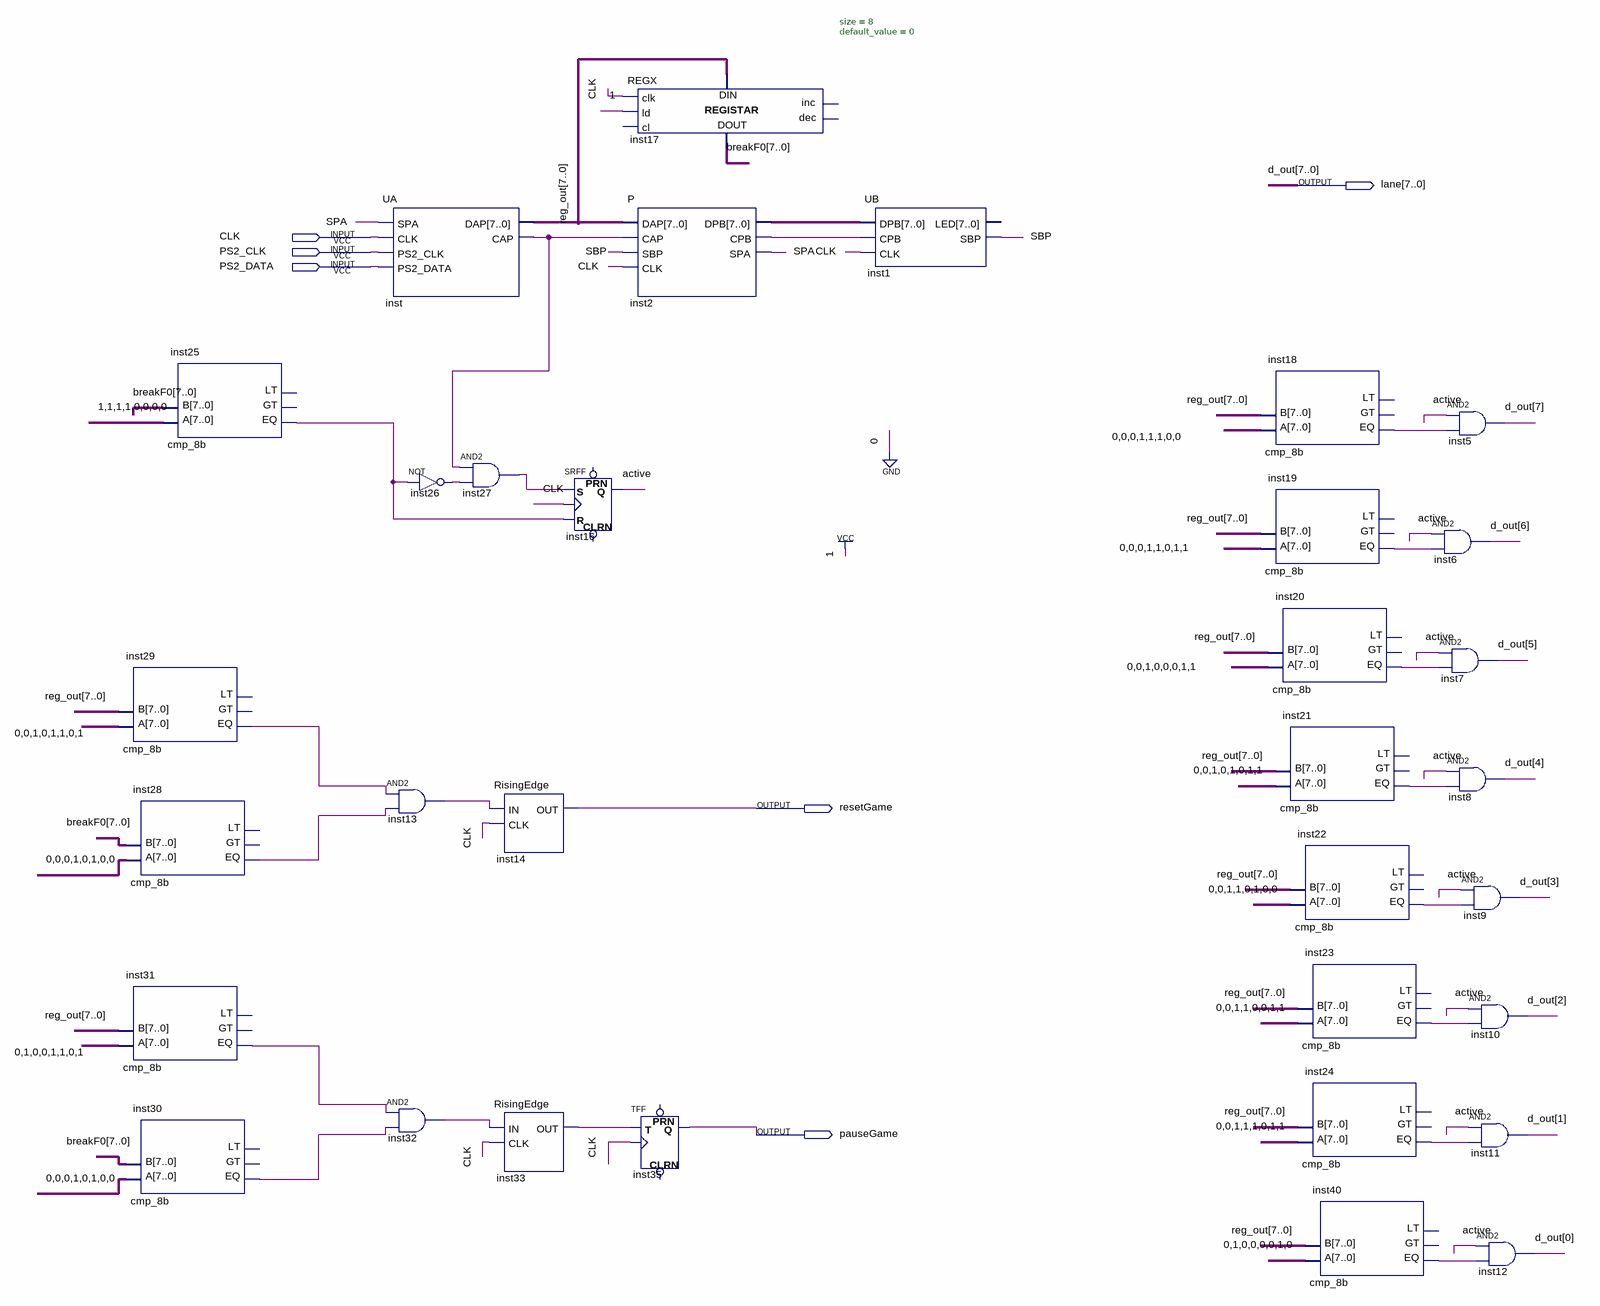
[diagram p0: schematic sheet]
// Quartus schematic Main.bdf as structural Verilog: 33 symbols, 6 pins
module Main (
  input  CLK,
  input  PS2_CLK,
  input  PS2_DATA,
  output [7:0] lane,
  output resetGame,
  output pauseGame
);

  wire active, inst2_cpb, inst13_out, inst18_eq, inst19_eq, inst20_eq, inst21_eq, inst22_eq, inst23_eq,
       inst24_eq, inst25_eq, inst26_out, inst27_out, inst28_eq, inst29_eq, inst30_eq, inst31_eq, inst32_out,
       inst33_out, inst40_eq, inst_cap, SBP, SPA;
  wire [7:0] breakF0, inst2_dpb, reg_out;

  cmp_8b inst25 (.A(8'b11110000), .B(breakF0), .EQ(inst25_eq));  // open: GT, LT
  cmp_8b inst29 (.A(8'b00101101), .B(reg_out), .EQ(inst29_eq));  // open: GT, LT
  cmp_8b inst28 (.A(8'b00010100), .B(breakF0), .EQ(inst28_eq));  // open: GT, LT
  cmp_8b inst31 (.A(8'b01001101), .B(reg_out), .EQ(inst31_eq));  // open: GT, LT
  cmp_8b inst30 (.A(8'b00010100), .B(breakF0), .EQ(inst30_eq));  // open: GT, LT
  UA inst (.SPA(SPA), .CLK(CLK), .PS2_CLK(PS2_CLK), .PS2_DATA(PS2_DATA), .DAP(reg_out), .CAP(inst_cap));
  and inst13 (inst13_out, inst29_eq, inst28_eq);
  and inst32 (inst32_out, inst31_eq, inst30_eq);
  and inst27 (inst27_out, inst_cap, inst26_out);
  not inst26 (inst26_out, inst25_eq);
  RisingEdge inst14 (.IN(inst13_out), .CLK(CLK), .OUT(resetGame));
  RisingEdge inst33 (.IN(inst32_out), .CLK(CLK), .OUT(inst33_out));
  SRFF inst16 (.S(inst27_out), .R(inst25_eq), .CLK(CLK), .Q(active));  // open: PRN, CLRN
  REGX #(.size(8), .default_value(0)) inst17 (
    .clk(CLK), .ld(1'b1), .data_in(reg_out), .data_out(breakF0));  // open: cl, inc, dec
  P inst2 (.DAP(reg_out), .CAP(inst_cap), .SBP(SBP), .CLK(CLK), .DPB(inst2_dpb), .CPB(inst2_cpb), .SPA(SPA));
  TFF inst35 (.T(inst33_out), .CLK(CLK), .Q(pauseGame));  // open: PRN, CLRN
  UB inst1 (.DPB(inst2_dpb), .CPB(inst2_cpb), .CLK(CLK), .SBP(SBP));  // open: LED
  cmp_8b inst18 (.A(8'b00011100), .B(reg_out), .EQ(inst18_eq));  // open: GT, LT
  cmp_8b inst19 (.A(8'b00011011), .B(reg_out), .EQ(inst19_eq));  // open: GT, LT
  cmp_8b inst20 (.A(8'b00100011), .B(reg_out), .EQ(inst20_eq));  // open: GT, LT
  cmp_8b inst21 (.A(8'b00101011), .B(reg_out), .EQ(inst21_eq));  // open: GT, LT
  cmp_8b inst22 (.A(8'b00110100), .B(reg_out), .EQ(inst22_eq));  // open: GT, LT
  cmp_8b inst23 (.A(8'b00110011), .B(reg_out), .EQ(inst23_eq));  // open: GT, LT
  cmp_8b inst24 (.A(8'b00111011), .B(reg_out), .EQ(inst24_eq));  // open: GT, LT
  cmp_8b inst40 (.A(8'b01000010), .B(reg_out), .EQ(inst40_eq));  // open: GT, LT
  and inst5 (lane[7], active, inst18_eq);
  and inst6 (lane[6], active, inst19_eq);
  and inst7 (lane[5], active, inst20_eq);
  and inst8 (lane[4], active, inst21_eq);
  and inst9 (lane[3], active, inst22_eq);
  and inst10 (lane[2], active, inst23_eq);
  and inst11 (lane[1], active, inst24_eq);
  and inst12 (lane[0], active, inst40_eq);

  // Other names for the same wires on the sheet: d_out[7:0] = lane
endmodule
